# Altium schematic sheet CT8042 Toplevel.SchDoc
size B; SheetNumber: 1; SheetTotal: 9
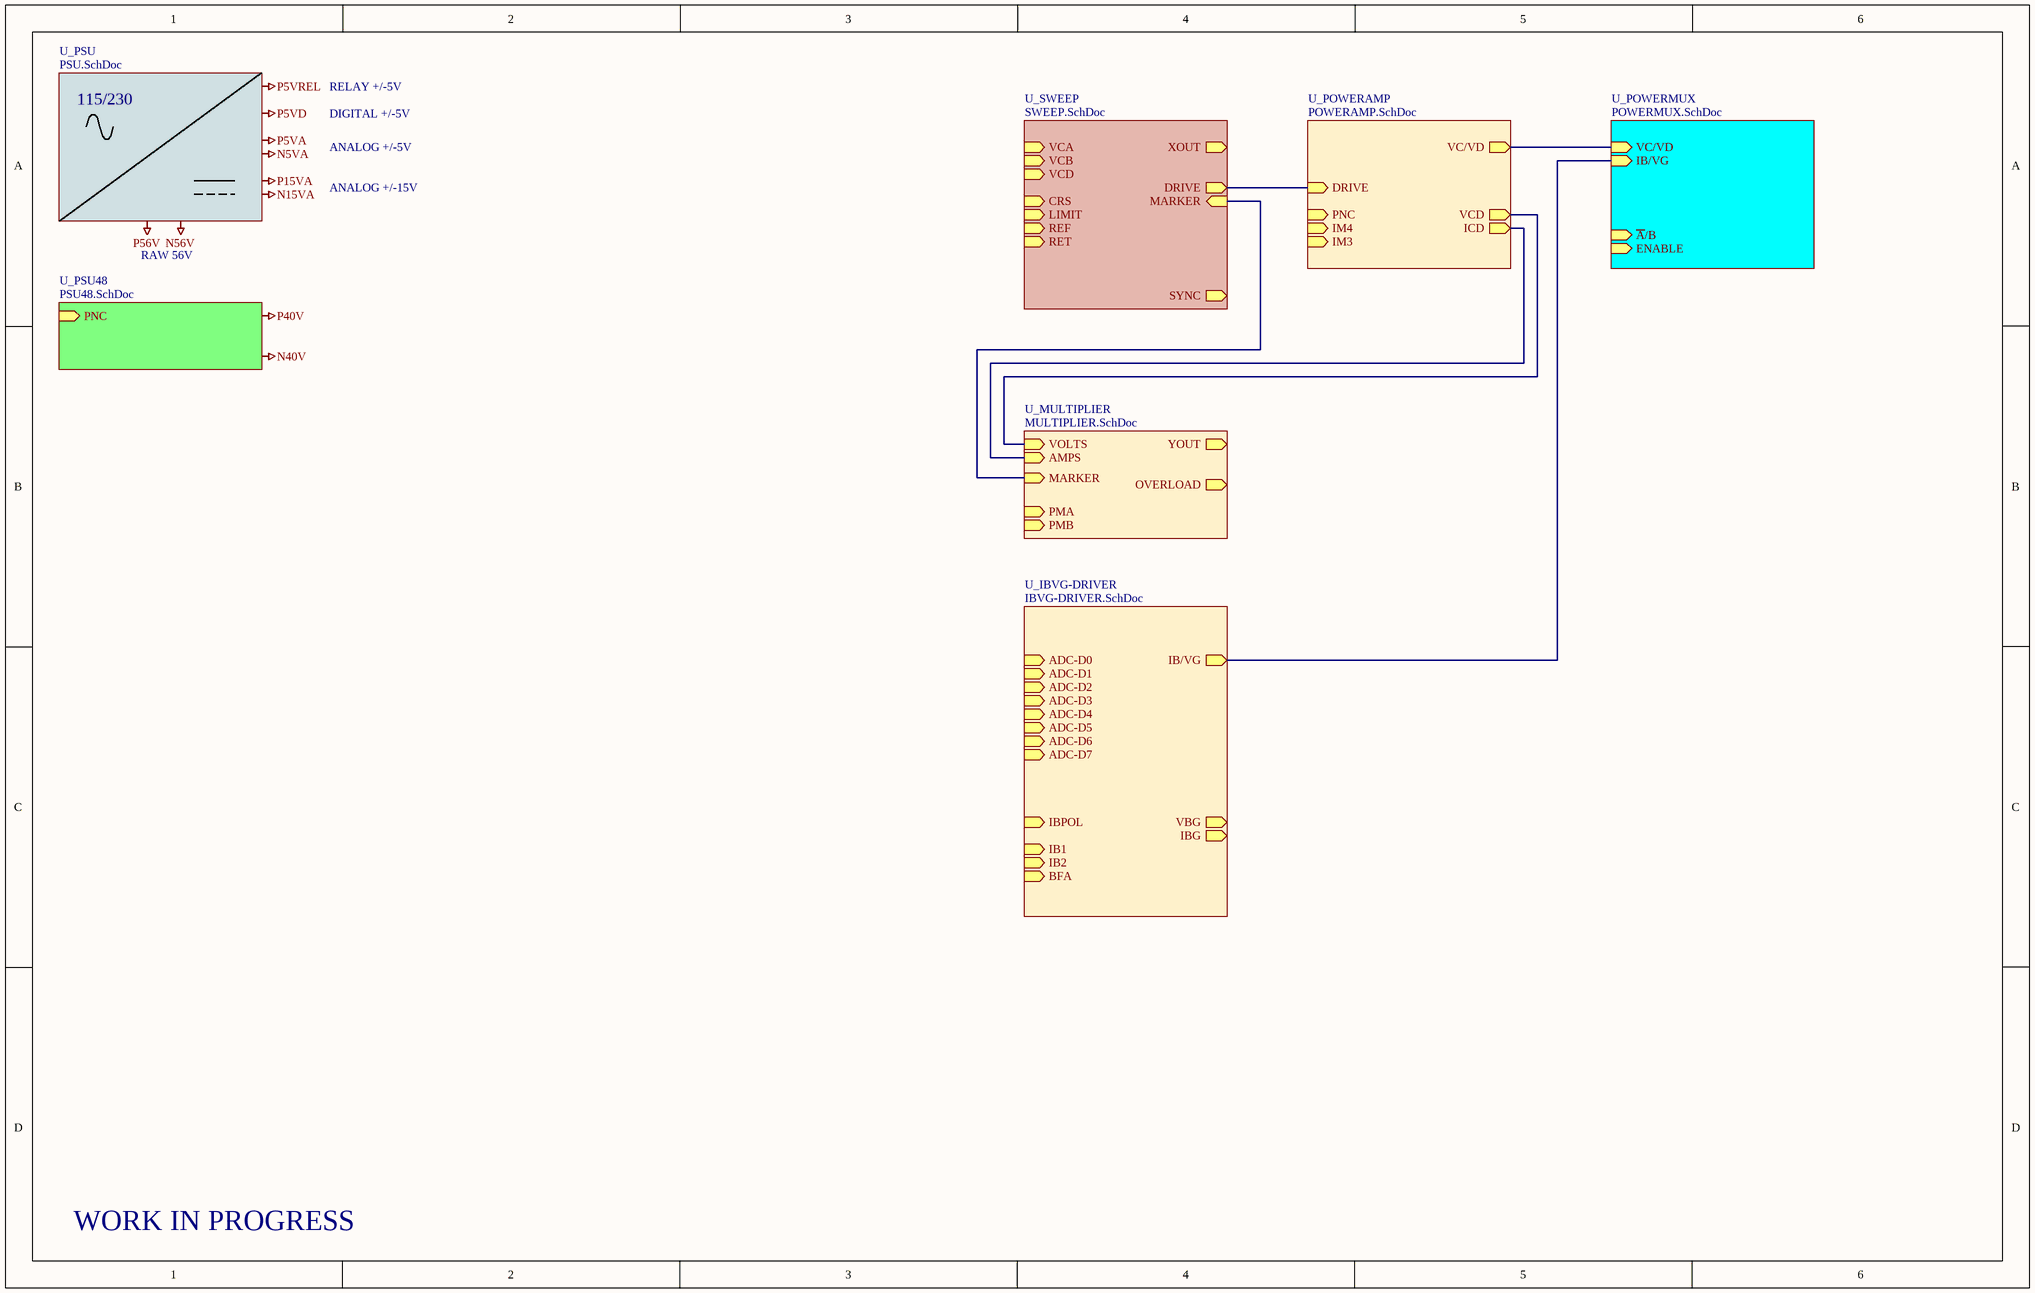
[diagram p0: CT8042 Toplevel.SchDoc]

## Sub-sheets
U_IBVG-DRIVER = IBVG-DRIVER.SchDoc: BFA (in), IB2 (in), IB1 (in), ADC-D0 (in), ADC-D1 (in), ADC-D2 (in), ADC-D3 (in), ADC-D4 (in), ADC-D5 (in), ADC-D6 (in), ADC-D7 (in), VBG (out), IBG (out), IBPOL (in), IB/VG (out)
U_MULTIPLIER = MULTIPLIER.SchDoc: PMA (in), PMB (in), OVERLOAD (out), VOLTS (in), AMPS (in), MARKER (in), YOUT (out)
U_POWERAMP = POWERAMP.SchDoc: VC/VD (out), ICD (out), PNC (in), DRIVE (in), IM3 (in), IM4 (in), VCD (out)
U_POWERMUX = POWERMUX.SchDoc: VC/VD (in), IB/VG (in), ~{A}/B (in), ENABLE (in)
U_PSU = PSU.SchDoc: no entries
U_PSU48 = PSU48.SchDoc: PNC (in)
U_SWEEP = SWEEP.SchDoc: RET (in), DRIVE (out), REF (in), SYNC (out), LIMIT (in), CRS (in), MARKER (in), XOUT (out), VCD (in), VCA (in), VCB (in)

## Nets
(unnamed): sheet U_POWERAMP/VC/VD, sheet U_POWERMUX/VC/VD
(unnamed): sheet U_POWERAMP/ICD, sheet U_MULTIPLIER/AMPS
(unnamed): sheet U_POWERAMP/DRIVE, sheet U_SWEEP/DRIVE
(unnamed): sheet U_POWERAMP/VCD, sheet U_MULTIPLIER/VOLTS
(unnamed): sheet U_IBVG-DRIVER/IB/VG, sheet U_POWERMUX/IB/VG
(unnamed): sheet U_SWEEP/MARKER, sheet U_MULTIPLIER/MARKER

## Notes on the sheet
- 115/230
- RELAY +/-5V
- ANALOG +/-5V
- DIGITAL +/-5V
- ANALOG +/-15V
- RAW 56V
- WORK IN PROGRESS
- Labels drawn without touching a wire or pin: N5VA, N15VA, N40V, N56V, P5VA, P5VD, P5VREL, P15VA, P40V, P56V